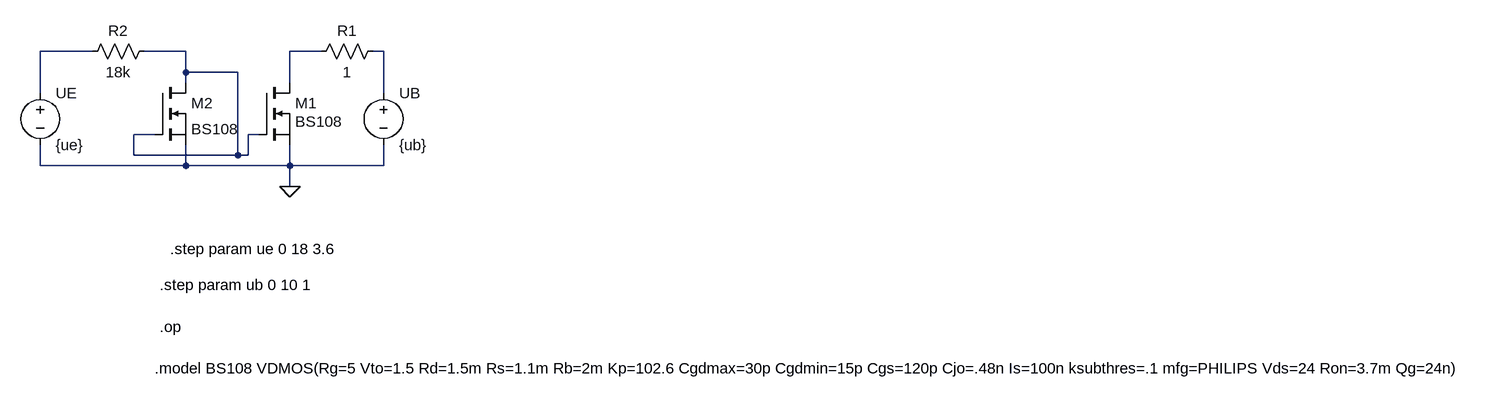
[diagram p0: schematic MOSFET.asc]
MOSFET.asc, the LTspice schematic file:
Version 4
SHEET 1 2016 680
WIRE -288 -160 -368 -160
WIRE -144 -160 -208 -160
WIRE 64 -160 16 -160
WIRE 160 -160 144 -160
WIRE -144 -128 -144 -160
WIRE -64 -128 -144 -128
WIRE -144 -112 -144 -128
WIRE 16 -112 16 -160
WIRE -368 -96 -368 -160
WIRE 160 -96 160 -160
WIRE -192 -32 -224 -32
WIRE -32 -32 -48 -32
WIRE -224 0 -224 -32
WIRE -64 0 -64 -128
WIRE -64 0 -224 0
WIRE -48 0 -48 -32
WIRE -48 0 -64 0
WIRE -368 16 -368 -16
WIRE -144 16 -144 -16
WIRE -144 16 -368 16
WIRE 16 16 16 -16
WIRE 16 16 -144 16
WIRE 160 16 160 -16
WIRE 160 16 16 16
WIRE 16 48 16 16
FLAG 16 48 0
SYMBOL nmos -32 -112 R0
WINDOW 3 56 60 Left 2
SYMATTR Value BS108
SYMATTR InstName M1
SYMBOL voltage 160 -112 R0
WINDOW 123 0 0 Left 0
WINDOW 39 0 0 Left 0
SYMATTR InstName UB
SYMATTR Value {ub}
SYMBOL voltage -368 -112 R0
WINDOW 123 0 0 Left 0
WINDOW 39 0 0 Left 0
SYMATTR InstName UE
SYMATTR Value {ue}
SYMBOL res 160 -176 R90
WINDOW 0 0 56 VBottom 2
WINDOW 3 32 56 VTop 2
SYMATTR InstName R1
SYMATTR Value 1
SYMBOL res -192 -176 R90
WINDOW 0 0 56 VBottom 2
WINDOW 3 32 56 VTop 2
SYMATTR InstName R2
SYMATTR Value 18k
SYMBOL nmos -192 -112 R0
SYMATTR InstName M2
SYMATTR Value BS108
TEXT -192 328 Left 2 !.model BS108 VDMOS(Rg=5 Vto=1.5 Rd=1.5m Rs=1.1m Rb=2m Kp=102.6 Cgdmax=30p Cgdmin=15p Cgs=120p Cjo=.48n Is=100n ksubthres=.1 mfg=PHILIPS Vds=24 Ron=3.7m Qg=24n)
TEXT -184 200 Left 2 !.step param ub 0 10 1
TEXT -184 264 Left 2 !.op
TEXT -168 144 Left 2 !.step param ue 0 18 3.6

The netlist it stands for:
* MOSFET.asc
M1 N003 N002 0 0 BS108
V§UB N004 0 {ub}
V§UE N001 0 {ue}
R1 N004 N003 1
R2 N002 N001 18k
M2 N002 N002 0 0 BS108
.model NMOS NMOS
.model PMOS PMOS
.lib standard.mos
.model BS108 VDMOS(Rg=5 Vto=1.5 Rd=1.5m Rs=1.1m Rb=2m Kp=102.6 Cgdmax=30p Cgdmin=15p Cgs=120p Cjo=.48n Is=100n ksubthres=.1 mfg=PHILIPS Vds=24 Ron=3.7m Qg=24n)
.step param ub 0 10 1
.op
.step param ue 0 18 3.6
.backanno
.end